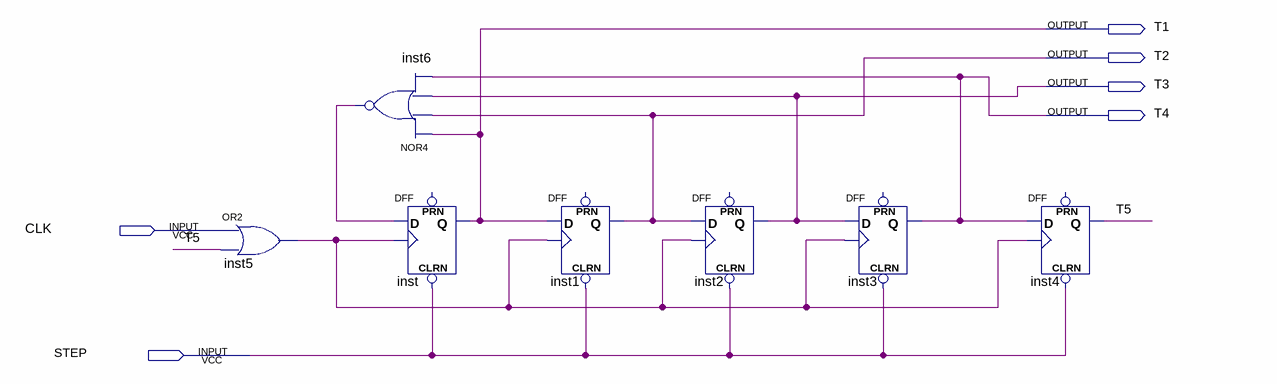
[diagram p0: schematic sheet]
// Quartus schematic Step3.bdf as structural Verilog: 7 symbols, 6 pins
module Step3 (
  input  CLK,
  input  STEP,
  output T1,
  output T2,
  output T3,
  output T4
);

  wire inst5_out, inst6_out, T5;

  or inst5 (inst5_out, CLK, T5);
  nor inst6 (inst6_out, T1, T2, T3, T4);
  DFF inst (.CLRN(STEP), .CLK(inst5_out), .D(inst6_out), .Q(T1));  // open: PRN
  DFF inst1 (.CLRN(STEP), .CLK(inst5_out), .D(T1), .Q(T2));  // open: PRN
  DFF inst2 (.CLRN(STEP), .CLK(inst5_out), .D(T2), .Q(T3));  // open: PRN
  DFF inst3 (.CLRN(STEP), .CLK(inst5_out), .D(T3), .Q(T4));  // open: PRN
  DFF inst4 (.CLRN(STEP), .CLK(inst5_out), .D(T4), .Q(T5));  // open: PRN
endmodule
